# Altium schematic sheet main board.SchDoc (part 1 of 3)
size 762 x 508 mm
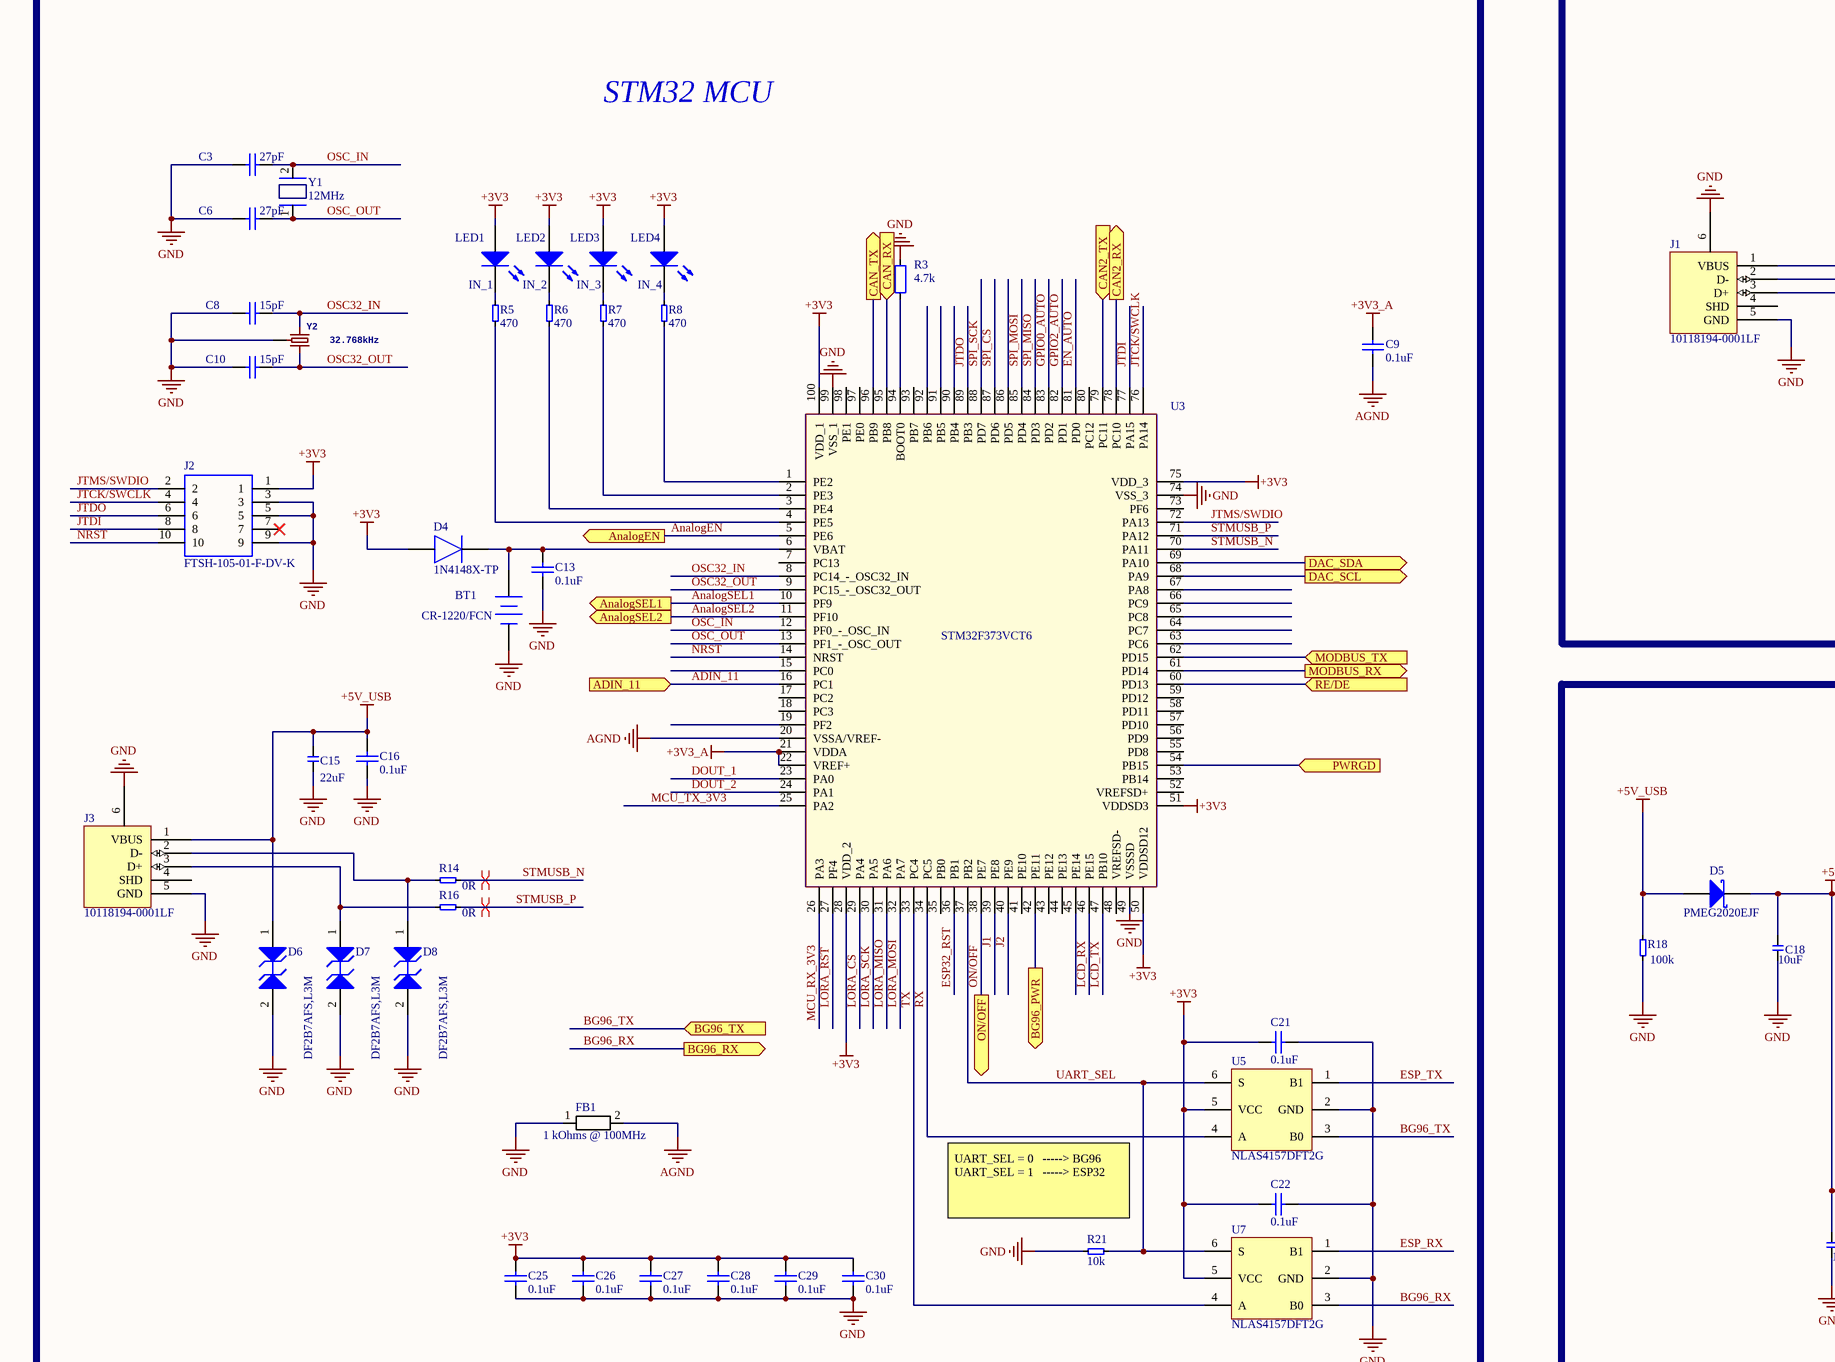
[diagram p0: main board.SchDoc, top left]
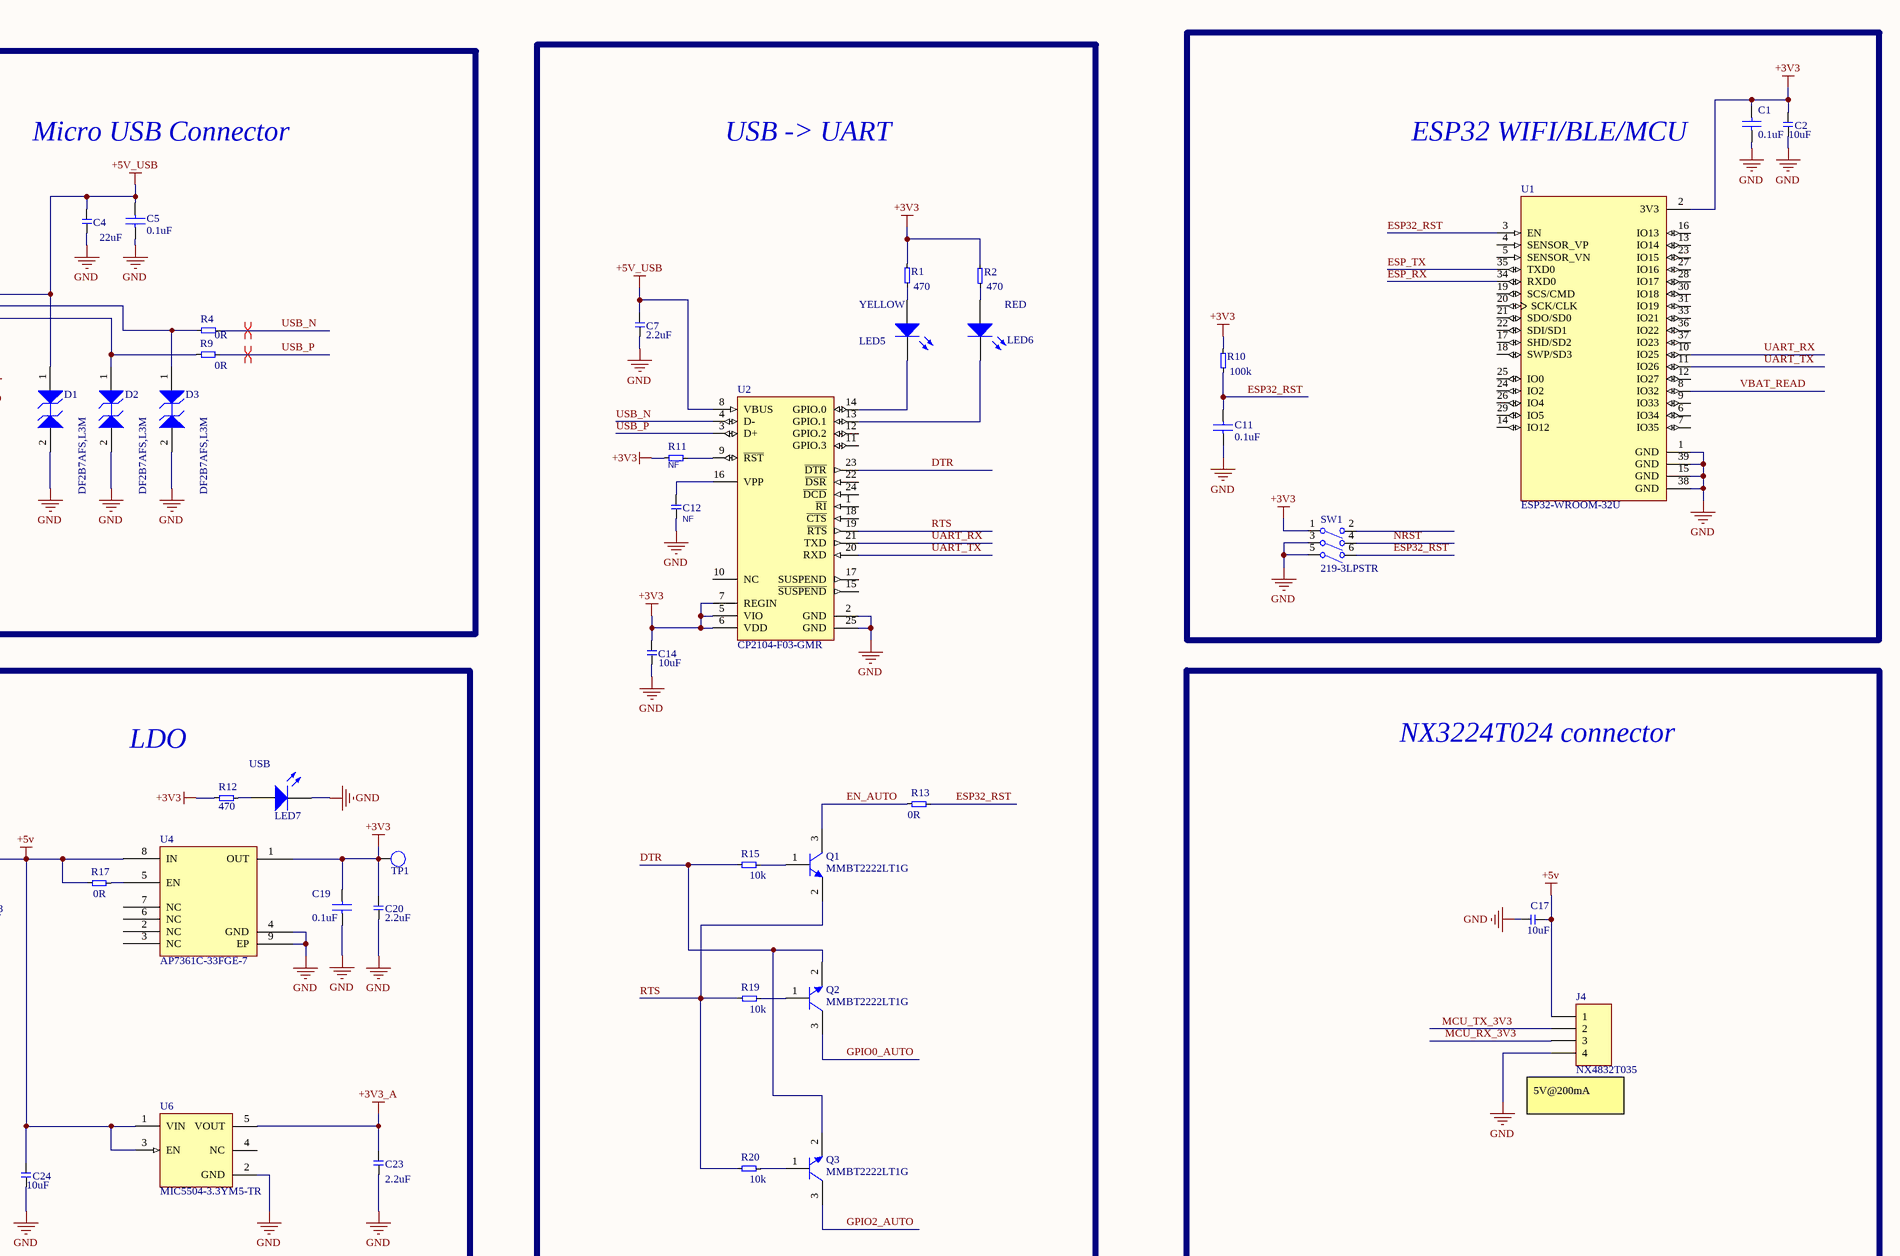
[diagram p1: main board.SchDoc, top right]
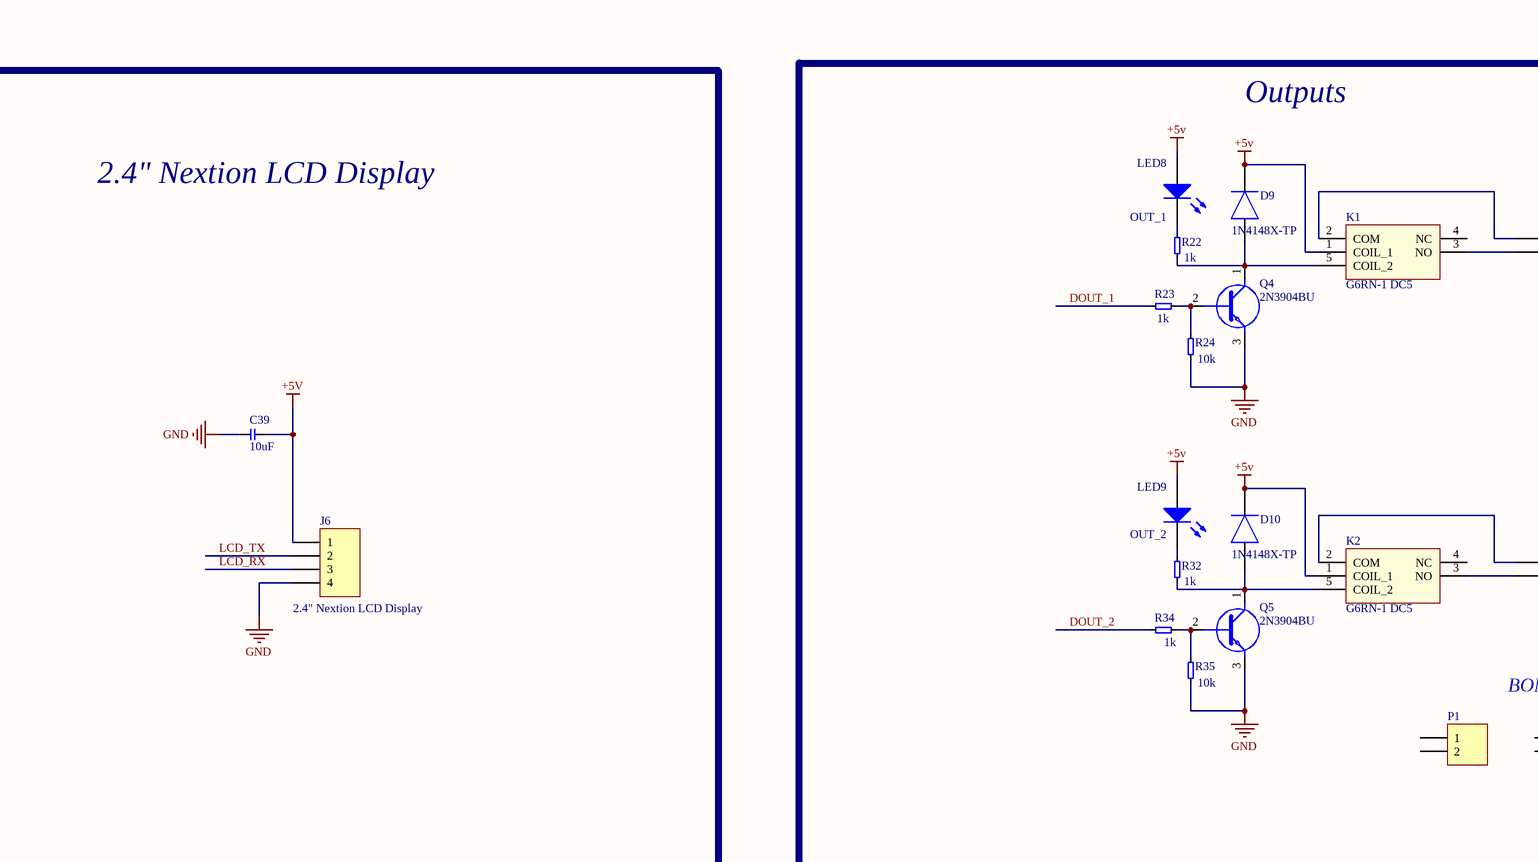
[diagram p2: main board.SchDoc, bottom left]
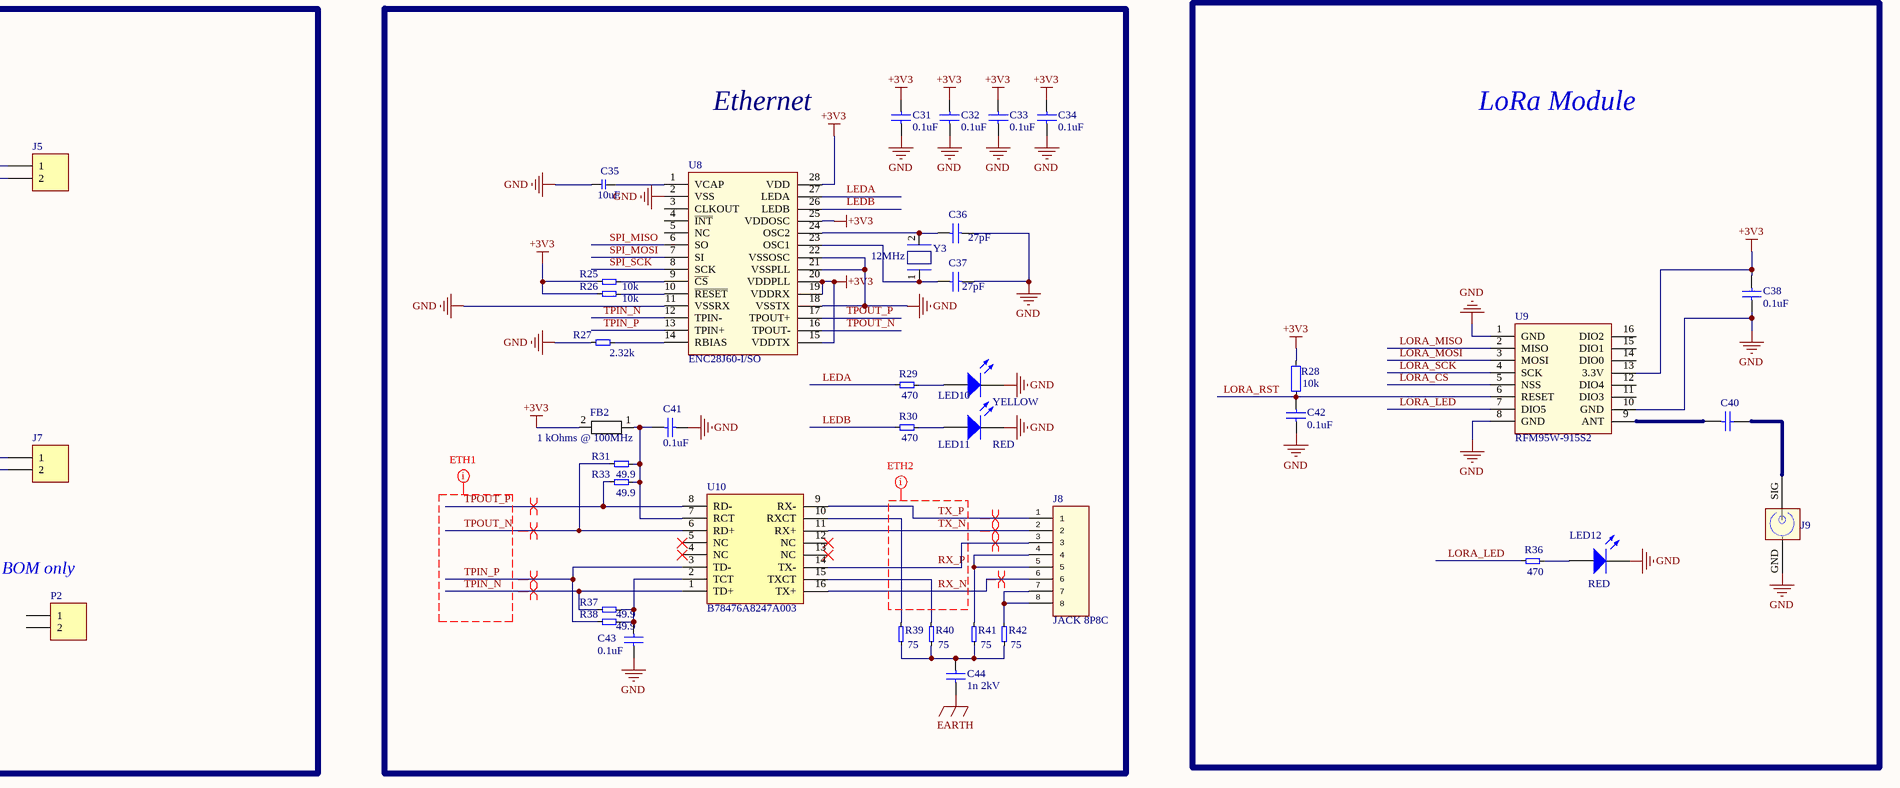
[diagram p3: main board.SchDoc, bottom right]

## Parts
BT1  CR-1220/FCN  [BATTERY_CR1220/FCN]
C1  0.1uF  [C_ceramic_0603]
C2  10uF  [C0603]
C3  27pF  [C0603]
C4  22uF  [C0805]
C5  0.1uF  [C_ceramic_0603]
C6  27pF  [C0603]
C7  2.2uF  [C0603]
C8  15pF  [C0603]
C9  0.1uF  [C_ceramic_0603]
C10  15pF  [C0603]
C11  0.1uF  [C_ceramic_0603]
C12  NF  [C_ceramic_0603]  (no BOM)
C13  0.1uF  [C_ceramic_0603]
C14  10uF  [C0603]
C15  22uF  [C0805]
C16  0.1uF  [C_ceramic_0603]
C17  10uF  [C0603]
C18  10uF  [C0603]
C19  0.1uF  [C_ceramic_0603]
C20  2.2uF  [C0603]
C21  0.1uF  [C_ceramic_0603]
C22  0.1uF  [C_ceramic_0603]
C23  2.2uF  [C0603]
C24  10uF  [C0603]
C25  0.1uF  [C_ceramic_0603]
C26  0.1uF  [C_ceramic_0603]
C27  0.1uF  [C_ceramic_0603]
C28  0.1uF  [C_ceramic_0603]
C29  0.1uF  [C_ceramic_0603]
C30  0.1uF  [C_ceramic_0603]
C31  0.1uF  [C_ceramic_0603]
C32  0.1uF  [C_ceramic_0603]
C33  0.1uF  [C_ceramic_0603]
C34  0.1uF  [C_ceramic_0603]
C35  10uF  [C0603]
C36  27pF  [C0603]
C37  27pF  [C0603]
C38  0.1uF  [C_ceramic_0603]
C39  10uF  [C0603]
C40  10pF  [C_ceramic_0603]  (value not drawn)
C41  0.1uF  [C_ceramic_0603]
C42  0.1uF  [C_ceramic_0603]
C43  0.1uF  [C_ceramic_0603]
C44  1n 2kV  [C1210]
D1  DF2B7AFS,L3M  [SOD323]
D2  DF2B7AFS,L3M  [SOD323]
D3  DF2B7AFS,L3M  [SOD323]
D4  1N4148X-TP  [SODFL1608X70N]
D5  PMEG2020EJF  [SOD323F]
D6  DF2B7AFS,L3M  [SOD323]
D7  DF2B7AFS,L3M  [SOD323]
D8  DF2B7AFS,L3M  [SOD323]
D9  1N4148X-TP  [SODFL1608X70N]
D10  1N4148X-TP  [SODFL1608X70N]
FB1  1 kOhms @ 100MHz  [FB 16080]
FB2  1 kOhms @ 100MHz  [FB 16080]
J1  10118194-0001LF  [10118194-0001LF]
J2  FTSH-105-01-F-DV-K  [SAMTEC_FTSH-105-01-L-DV]
J3  10118194-0001LF  [10118194-0001LF]
J4  NX4832T035  [CON4_P2.54]
J5  CIM025P5  [CON2_P5.08_CIM025P5]  (value not drawn)
J6  2.4" Nextion LCD Display  [CON4_P2.54]
J7  CIM025P5  [CON2_P5.08_CIM025P5]  (value not drawn)
J8  JACK 8P8C  [RJ45_0956223981]
J9  U.FL-R-SMT(10)  [RPSMA_5-1814400-1]  (value not drawn)
K1  G6RN-1 DC5  [G6RN-1]
K2  G6RN-1 DC5  [G6RN-1]
LED1  IN_1  [LED0603_1]
LED2  IN_2  [LED0603_1]
LED3  IN_3  [LED0603_1]
LED4  IN_4  [LED0603_1]
LED5  YELLOW  [LED0603_1]
LED6  RED  [LED0603_1]
LED7  USB  [LED0603_1]
LED8  OUT_1  [LED0603_1]
LED9  OUT_2  [LED0603_1]
LED10  YELLOW  [LED0603_1]
LED11  RED  [LED0603_1]
LED12  RED  [LED0603_1]
P1  BOM ONLY  (value not drawn)  (mechanical)
P2  BOM ONLY  (value not drawn)  (mechanical)
Q1  MMBT2222LT1G  [SOT23-3]
Q2  MMBT2222LT1G  [SOT23-3]
Q3  MMBT2222LT1G  [SOT23-3]
Q4  2N3904BU  [TO127P419X482X533-3P]
Q5  2N3904BU  [TO127P419X482X533-3P]
R1  470  [R_0603]
R2  470  [R_0603]
R3  4.7k  [R0603]
R4  0R  [R_0603]
R5  470  [R_0603]
R6  470  [R_0603]
R7  470  [R_0603]
R8  470  [R_0603]
R9  0R  [R_0603]
R10  100k  [R_0603]
R11  NF  [R_0603]  (no BOM)
R12  470  [R_0603]
R13  0R  [R_0603]
R14  0R  [R_0603]
R15  10k  [R_0603]
R16  0R  [R_0603]
R17  0R  [R_0603]
R18  100k  [R_0603]
R19  10k  [R_0603]
R20  10k  [R_0603]
R21  10k  [R_0603]
R22  1k  [R_0603]
R23  1k  [R_0603]
R24  10k  [R_0603]
R25  10k  [R_0603]
R26  10k  [R_0603]
R27  2.32k  [R_0603]
R28  10k  [R0603]
R29  470  [R_0603]
R30  470  [R_0603]
R31  49.9  [R_0603]
R32  1k  [R_0603]
R33  49.9  [R_0603]
R34  1k  [R_0603]
R35  10k  [R_0603]
R36  470  [R_0603]
R37  49.9  [R_0603]
R38  49.9  [R_0603]
R39  75  [R_0603]
R40  75  [R_0603]
R41  75  [R_0603]
R42  75  [R_0603]
SW1  219-3LPSTR  [219-3LPSTR]
TP1  Test point  [TP]  (value not drawn)  (no BOM)
U1  ESP32-WROOM-32U  [ESP32-WROOM-32U]
U2  CP2104-F03-GMR  [QFN-24]
U3  STM32F373VCT6  [QFP50P1600X1600X160-100N]
U4  AP7361C-33FGE-7  [DFN3030-8]
U5  NLAS4157DFT2G  [SC-88]
U6  MIC5504-3.3YM5-TR  [SOT23-5]
U7  NLAS4157DFT2G  [SC-88]
U8  ENC28J60-I/SO  [SOIC127P1030X265-28N]
U9  RFM95W-915S2  [RFM95W-915S2]
U10  B78476A8247A003  [TRANS_LAN_B78476A8247A003]
Y1  12MHz  [XTAL_DIP]
Y2  32.768kHz  [TC26H_3_REPAIR_SMD]
Y3  12MHz  [XTAL_DIP]

## Ports
ADIN_11 (in), AnalogEN (out), AnalogSEL1 (out), AnalogSEL2 (out), BG96_PWR (out), BG96_RX (out), BG96_TX (in), CAN2_RX (out), CAN2_TX (in), CAN_RX (in), CAN_TX (out), DAC_SCL (out), DAC_SDA (out), MODBUS_RX (out), MODBUS_TX (in), ON/OFF (out), PWRGD (in), RE/DE (in)

## Nets
+3V3: C1.1 C2.2 C14.2 C19.1 C20.2 C21.1 C22.1 C25.1 C26.1 C27.1 C28.1 C29.1 C30.1 C31.1 C32.1 C33.1 C34.1 C38.2 D4.2(A) FB2.2 J2.1 LED1.1(A) LED2.1(A) LED3.1(A) LED4.1(A) R1.2 R2.2 R10.2 R11.1 R12.2 R25.1 R26.1 R28.2 SW1.1 TP1.1(TP) U1.2(3V3) U2.5(VIO) U2.6(VDD) U2.7(REGIN) U3.28(VDD_2) U3.50(VDDSD12) U3.51(VDDSD3) U3.75(VDD_3) U3.100(VDD_1) U4.1(OUT) U5.5(VCC) U7.5(VCC) U8.15(VDDTX) U8.19(VDDRX) U8.20(VDDPLL) U8.25(VDDOSC) U8.28(VDD) U9.13(3.3V)
+3V3_A: C9.2 C23.2 U3.21(VDDA) U3.22(VREF+) U6.5(VOUT)
+5v: C17.1 C18.2 C24.2 C39.1 D5.1(K) D9.1(K) D10.1(K) J4.1 J6.1 K1.1(COIL_1) K2.1(COIL_1) LED8.1(A) LED9.1(A) R17.1 U4.8(IN) U6.1(VIN) U6.3(EN)
+5V_USB: C4.2 C5.1 C7.2 C15.2 C16.1 D1.1(A1) D5.2(A) D6.1(A1) J1.1(VBUS) J3.1(VBUS) R18.2 U2.8(VBUS)
AGND: C9.1 FB1.2 U3.20(VSSA/VREF-)
EARTH: C44.1
GND: BT1.2(-) C1.2 C2.1 C3.1 C4.1 C5.2 C6.1 C7.1 C8.1 C10.1 C11.1 C12.1 C13.2 C14.1 C15.1 C16.2 C17.2 C18.1 C19.2 C20.1 C21.2 C22.2 C23.1 C24.1 C25.2 C26.2 C27.2 C28.2 C29.2 C30.2 C31.2 C32.2 C33.2 C34.2 C35.1 C36.1 C37.1 C38.1 C39.2 C41.1 C42.1 C43.1 D1.2(A2) D2.2(A2) D3.2(A2) D6.2(A2) D7.2(A2) D8.2(A2) FB1.1 J1.5(GND) J1.6 J2.3 J2.5 J2.9 J3.5(GND) J3.6 J4.4 J6.4 J9.GND LED7.2(K) LED10.2(K) LED11.2(K) LED12.2(K) Q4.3(E) Q5.3(E) R3.2 R18.1 R21.2 R24.1 R27.1 R35.1 SW1.3 SW1.5 U1.1(GND) U1.15(GND) U1.38(GND) U1.39(GND) U2.2(GND) U2.25(GND) U3.49(VSSSD) U3.74(VSS_3) U3.99(VSS_1) U4.4(GND) U4.9(EP) U5.2(GND) U6.2(GND) U7.2(GND) U8.2(VSS) U8.11(VSSRX) U8.18(VSSTX) U8.21(VSSPLL) U8.22(VSSOSC) U9.1(GND) U9.8(GND) U9.10(GND) Y2.GND
ADIN_11: U3.16(PC1) ; port ADIN_11
AnalogEN: U3.5(PE6) ; port AnalogEN
AnalogSEL1: U3.10(PF9) ; port AnalogSEL1
AnalogSEL2: U3.11(PF10) ; port AnalogSEL2
BG96_PWR: U3.42(PE11) ; port BG96_PWR
BG96_RX: U7.3(B0) ; port BG96_RX
BG96_TX: U5.3(B0) ; port BG96_TX
CAN2_RX: U3.78(PC10) ; port CAN2_RX
CAN2_TX: U3.79(PC11) ; port CAN2_TX
CAN_RX: U3.95(PB8) ; port CAN_RX
CAN_TX: U3.96(PB9) ; port CAN_TX
DAC_SCL: U3.68(PA9) ; port DAC_SCL
DAC_SDA: U3.69(PA10) ; port DAC_SDA
DOUT_1: R23.1 U3.23(PA0)
DOUT_2: R34.1 U3.24(PA1)
DTR: Q2.2(E) Q3.2(E) R15.1 U2.23(~{DTR})
EN_AUTO: Q1.3(C) R13.1 U3.81(PD0)
ESP32_RST: C11.2 R10.1 R13.2 SW1.6 U1.3(EN) U3.36(PB1)
ESP_RX: U1.34(RXD0) U7.1(B1)
ESP_TX: U1.35(TXD0) U5.1(B1)
GPIO0_AUTO: Q2.3(C) U3.83(PD2)
GPIO2_AUTO: Q3.3(C) U3.82(PD1)
J1: U3.39(PE8)
J2: U3.40(PE9)
JTCK/SWCLK: J2.4 U3.76(PA14)
JTDI: J2.8 U3.77(PA15)
JTDO: J2.6 U3.89(PB3)
JTMS/SWDIO: J2.2 U3.72(PA13)
LCD_RX: J6.3 U3.46(PE15)
LCD_TX: J6.2 U3.47(PB10)
LEDA: R29.1 U8.27(LEDA)
LEDB: R30.1 U8.26(LEDB)
LORA_CS: U3.29(PA4) U9.5(NSS)
LORA_LED: R36.1 U9.7(DIO5)
LORA_MISO: U3.31(PA6) U9.2(MISO)
LORA_MOSI: U3.32(PA7) U9.3(MOSI)
LORA_RST: C42.2 R28.1 U3.27(PF4) U9.6(RESET)
LORA_SCK: U3.30(PA5) U9.4(SCK)
MCU_RX_3V3: J4.3 U3.26(PA3)
MCU_TX_3V3: J4.2 U3.25(PA2)
MODBUS_RX: U3.61(PD14) ; port MODBUS_RX
MODBUS_TX: U3.62(PD15) ; port MODBUS_TX
NRST: J2.10 SW1.4 U3.14(NRST)
ON/OFF: U3.38(PE7) ; port ON/OFF
OSC32_IN: C8.2 U3.8(PC14_-_OSC32_IN) Y2.2
OSC32_OUT: C10.2 U3.9(PC15_-_OSC32_OUT) Y2.1
OSC_IN: C3.2 U3.12(PF0_-_OSC_IN) Y1.2
OSC_OUT: C6.2 U3.13(PF1_-_OSC_OUT) Y1.1
PWRGD: U3.54(PB15) ; port PWRGD
RE/DE: U3.60(PD13) ; port RE/DE
RTS: Q1.2(E) R19.1 R20.1 U2.19(~{RTS})
RX: U3.34(PC5) U5.4(A)
RX_N: J8.6 U10.16(TX+)
RX_P: J8.3 U10.14(TX-)
SPI_CS: U3.87(PD6)
SPI_MISO: U3.84(PD3) U8.6(SO)
SPI_MOSI: U3.85(PD4) U8.7(SI)
SPI_SCK: U3.88(PD7) U8.8(SCK)
STMUSB_N: R14.2 U3.70(PA11)
STMUSB_P: R16.2 U3.71(PA12)
TPIN_N: R37.1 U8.12(TPIN-) U10.1(TD+)
TPIN_P: R38.1 U8.13(TPIN+) U10.3(TD-)
TPOUT_N: R31.1 U8.16(TPOUT-) U10.6(RD+)
TPOUT_P: R33.1 U8.17(TPOUT+) U10.8(RD-)
TX: U3.33(PC4) U7.4(A)
TX_N: J8.2 U10.11(RX+)
TX_P: J8.1 U10.9(RX-)
UART_RX: U1.10(IO25) U2.21(TXD)
UART_SEL: R21.1 U3.37(PB2) U5.6(S) U7.6(S)
UART_TX: U1.11(IO26) U2.20(RXD)
USB_N: R4.2 U2.4(D-)
USB_P: R9.2 U2.3(D+)
VBAT_READ: U1.8(IO32)
NetBT1_1: BT1.1(+) C13.1 D4.1(K) U3.6(VBAT)
NetC12_2: C12.2 U2.16(VPP)
NetC35_2: C35.2 U8.1(VCAP)
NetC36_2: C36.2 U8.24(OSC2) Y3.2
NetC37_2: C37.2 U8.23(OSC1) Y3.1
NetC40_1: C40.1 J9.SIG
NetC40_2: C40.2 U9.9(ANT)
NetC41_2: C41.2 FB2.1 R31.2 R33.2 U10.7(RCT)
NetC43_2: C43.2 R37.2 R38.2 U10.2(TCT)
NetC44_2: C44.2 R39.1 R40.1 R41.1 R42.1
NetD2_1: D2.1(A1) J1.3(D+) R9.1
NetD3_1: D3.1(A1) J1.2(D-) R4.1
NetD7_1: D7.1(A1) J3.3(D+) R16.1
NetD8_1: D8.1(A1) J3.2(D-) R14.1
NetD9_2: D9.2(A) K1.5(COIL_2) Q4.1(C) R22.1
NetD10_2: D10.2(A) K2.5(COIL_2) Q5.1(C) R32.1
NetJ5_1: J5.1 K1.2(COM)
NetJ5_2: J5.2 K1.3(NO)
NetJ7_1: J7.1 K2.2(COM)
NetJ7_2: J7.2 K2.3(NO)
NetJ8_4: J8.4 J8.5 R41.2
NetJ8_7: J8.7 J8.8 R42.2
NetLED1_2: LED1.2(K) R5.2
NetLED2_2: LED2.2(K) R6.2
NetLED3_2: LED3.2(K) R7.2
NetLED4_2: LED4.2(K) R8.2
NetLED5_1: LED5.1(A) R1.1
NetLED5_2: LED5.2(K) U2.14(GPIO.0)
NetLED6_1: LED6.1(A) R2.1
NetLED6_2: LED6.2(K) U2.13(GPIO.1)
NetLED7_1: LED7.1(A) R12.1
NetLED8_2: LED8.2(K) R22.2
NetLED9_2: LED9.2(K) R32.2
NetLED10_1: LED10.1(A) R29.2
NetLED11_1: LED11.1(A) R30.2
NetLED12_1: LED12.1(A) R36.2
NetQ1_1: Q1.1(B) R15.2
NetQ2_1: Q2.1(B) R19.2
NetQ3_1: Q3.1(B) R20.2
NetQ4_2: Q4.2(B) R23.2 R24.2
NetQ5_2: Q5.2(B) R34.2 R35.2
NetR3_1: R3.1 U3.94(BOOT0)
NetR5_1: R5.1 U3.4(PE5)
NetR6_1: R6.1 U3.3(PE4)
NetR7_1: R7.1 U3.2(PE3)
NetR8_1: R8.1 U3.1(PE2)
NetR11_2: R11.2 U2.9(~{RST})
NetR17_2: R17.2 U4.5(EN)
NetR25_2: R25.2 U8.9(~{CS})
NetR26_2: R26.2 U8.10(~{RESET})
NetR27_2: R27.2 U8.14(RBIAS)
NetR39_2: R39.2 U10.10(RXCT)
NetR40_2: R40.2 U10.15(TXCT)

Not connected (* = marked no-connect by the designer): J1 4(SHD); J2 7*; J3 4(SHD); K1 4(NC); K2 4(NC); P1 1 2; P2 1 2; SW1 2; U1 4(SENSOR_VP) 5(SENSOR_VN) 6(IO34) 7(IO35) 9(IO33) 12(IO27) 13(IO14) 14(IO12) 16(IO13) 17(SHD/SD2) 18(SWP/SD3) 19(SCS/CMD) 20(SCK/CLK) 21(SDO/SD0) 22(SDI/SD1) 23(IO15) 24(IO2) 25(IO0) 26(IO4) 27(IO16) 28(IO17) 29(IO5) 30(IO18) 31(IO19) 33(IO21) 36(IO22) 37(IO23); U2 1(~{RI}) 10(NC) 11(GPIO.3) 12(GPIO.2) 15(~{SUSPEND}) 17(SUSPEND) 18(~{CTS}) 22(~{DSR}) 24(~{DCD}); U3 7(PC13) 15(PC0) 17(PC2) 18(PC3) 19(PF2) 35(PB0) 41(PE10) 43(PE12) 44(PE13) 45(PE14) 48(VREFSD-) 52(VREFSD+) 53(PB14) 55(PD8) 56(PD9) 57(PD10) 58(PD11) 59(PD12) 63(PC6) 64(PC7) 65(PC8) 66(PC9) 67(PA8) 73(PF6) 80(PC12) 86(PD5) 90(PB4) 91(PB5) 92(PB6) 93(PB7) 97(PE0) 98(PE1); U4 2(NC) 3(NC) 6(NC) 7(NC); U6 4(NC); U8 3(CLKOUT) 4(~{INT}) 5(NC); U9 11(DIO3) 12(DIO4) 14(DIO0) 15(DIO1) 16(DIO2); U10 4(NC)* 5(NC)* 12(NC)* 13(NC)*

## Layout directives
differential pair; differential pair class USB_STM: STMUSB_N, STMUSB_P
differential pair; differential pair class USB_UART: USB_N, USB_P
differential pair; differential pair class TO: TPOUT_N, TPOUT_P
net class ETH1: TPIN_N, TPIN_P, TPOUT_N, TPOUT_P
differential pair; differential pair class TI: TPIN_N, TPIN_P
net class ETH2: RX_N, RX_P, TX_N, TX_P
differential pair; differential pair class TX: TX_N, TX_P
differential pair; differential pair class RX: RX_N, RX_P

## Notes on the sheet
- STM32 MCU
- Micro USB Connector
- USB -> UART
- ESP32 WIFI/BLE/MCU
- LDO
- NX3224T024 connector
- (near R21) UART_SEL = 0   -----> BG96
  UART_SEL = 1   -----> ESP32
- (near J4) 5V@200mA
- Outputs
- 2.4" Nextion LCD Display
- Ethernet
- LoRa Module
- (near P2) BOM only